# EAGLE design xerife (EAGLE 5.06)
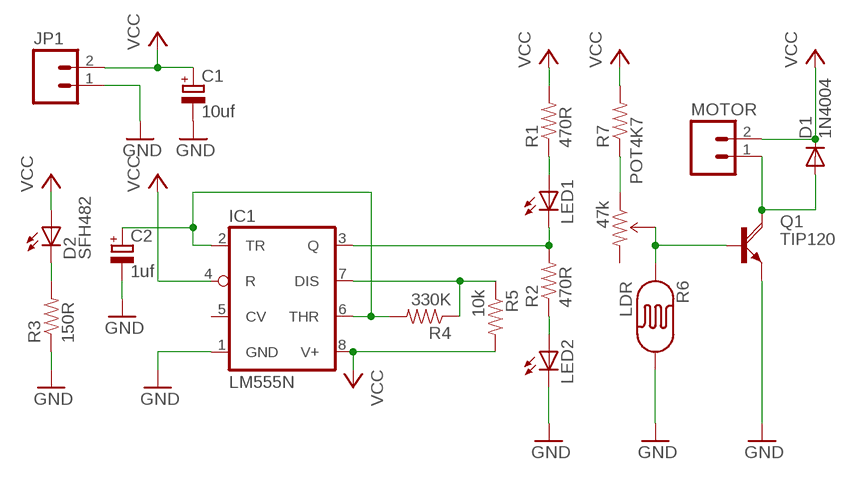
[diagram p0: schematic, sheet 1]

## Parts
C1  10uf  CPOL-EUE5-5  [E5-5]
C2  1uf  CPOL-EUE5-5  [E5-5]
D1  1N4004  [DO41-10]
D2  SFH482  [SFH482]
IC1  LM555N  [DIL08-ROUND]
JP1  M025MM  [SCREWTERMINAL-5MM-2]
LED1  LED5MM  [LED5MM]
LED2  LED5MM  [LED5MM]
MOTOR  M021X02_NO_SILK  [1X02_NO_SILK]
POT  47k  TRIMPOTPTH  [TRIM_POT_PTH]
Q1  TIP120  [TO220AH]
R1  470R  RESISTORPTH-1/4W  [AXIAL-0.4]
R2  470R  RESISTORPTH-1/4W  [AXIAL-0.4]
R3  150R  RESISTORPTH-1/4W  [AXIAL-0.4]
R4  330K  RESISTORPTH-1/4W  [AXIAL-0.4]
R5  10k  RESISTORPTH-1/4W  [AXIAL-0.4]
R6  LDR  PHOTOCELLPTH-KIT  [PHOTOCELL-KIT]
R7  4K7  RESISTORPTH-1/4W  [AXIAL-0.4]

## Nets
GND: C1.- C2.- IC1.1(GND) JP1.1 LED2.K(C) Q1.E R3.P$1 R6.2
N$1: LED1.A R1.P$1
N$2: IC1.3(Q) LED1.K(C) R2.P$2
N$3: LED2.A R2.P$1
N$4: C2.+ IC1.2(TR) IC1.6(THR) R4.P$2
N$5: IC1.7(DIS) R4.P$1 R5.P$1
N$6: D2.K(C) R3.P$2
N$7: D1.A MOTOR.1 Q1.C
N$8: POT.1(CCW) R7.P$1
N$9: POT.2(WIPER) Q1.B R6.1
VCC: C1.+ D1.C D2.A IC1.4(R) IC1.8(V+) JP1.2 MOTOR.2 R1.P$2 R5.P$2 R7.P$2
Unconnected: IC1.5(CV) POT.3(CW)

## Library data of the parts
C1 C2 = rcl:CPOL-EU: POLARIZED CAPACITOR, European symbol
D1 = adafruit:1N4004: DIODE General purpose 1N400x type rectifier (With bigger pads) http://www.ladyada.net/library/pcb/eaglelibrary.html
D2 = led:SFH482: IR LED infrared emitting diode, Infineon
IC1 = adafruit:*555: TIMER Changed DIP package to have round (not oval) pin pads http://www.ladyada.net/library/pcb/eaglelibrary.html
JP1 MOTOR = SparkFun:M02: Header 2 Standard 2-pin 0.1" header. Use with straight break away headers (SKU : PRT-00116), right angle break away headers (PRT-00553), swiss pins (PRT-00743), machine pins (PRT-00117), and female headers (PRT-00115). Molex polarized connector foot print use with SKU : PRT-08233 with associated crimp pins and housings.
LED1 LED2 = adafruit:LED: LED OSRAM: - CHIPLED LG R971, LG N971, LY N971, LG Q971, LY Q971, LO R971, LY R971 LH N974, LH R974 LS Q976, LO Q976, LY Q976 LO Q996 - Hyper CHIPLED LW Q18S LB Q993, LB Q99A, LB R99A - SideLED LS A670, LO A670, LY A670, LG A670, LP A670 LB A673, LV A673, LT A673, LW A673 LH A674 LY A675 LS A676, LA A676, LO A676, LY A676, LW A676 LS A679, LY A679, LG A679 - Hyper Micro SIDELED® LS Y876, LA Y876, LO Y876, LY Y876 LT Y87S - SmartLED LW L88C, LW L88S LB L89C, LB L89S, LG L890 LS L89K, LO L89K, LY L89K LS L896, LA L896, LO L896, LY L896 - TOPLED LS T670, LO T670, LY T670, LG T670, LP T670 LSG T670, LSP T670, LSY T670, LOP T670, LYG T670 LG T671, LOG T671, LSG T671 LB T673, LV T673, LT T673, LW T673 LH T674 LS T676, LA T676, LO T676, LY T676, LB T676, LH T676, LSB T676, LW T676 LB T67C, LV T67C, LT T67C, LS T67K, LO T67K, LY T67K, LW E67C LS E67B, LA E67B, LO E67B, LY E67B, LB E67C, LV E67C, LT E67C LW T67C LS T679, LY T679, LG T679 LS T770, LO T770, LY T770, LG T770, LP T770 LB T773, LV T773, LT T773, LW T773 LH T774 LS E675, LA E675, LY E675, LS T675 LS T776, LA T776, LO T776, LY T776, LB T776 LHGB T686 LT T68C, LB T68C - Hyper Mini TOPLED® LB M676 - Mini TOPLED Santana® LG M470 LS M47K, LO M47K, LY M47K Source: http://www.osram.convergy.de/
POT = SparkFun:TRIMPOT
Q1 = transistor-power:TIP120: NPN DARLINGTON TRANSISTOR
R1-R5 R7 = SparkFun:RESISTOR: Resistor Basic schematic elements and footprints for 0603, 1206, and PTH resistors.
R6 = SparkFun:PHOTOCELL: Photocell Also known as a CdS photoresistor. This is a low cost way to detect light levels. Resistance decreases with more incoming light. SparkFun SKU: SEN-09088

## Board
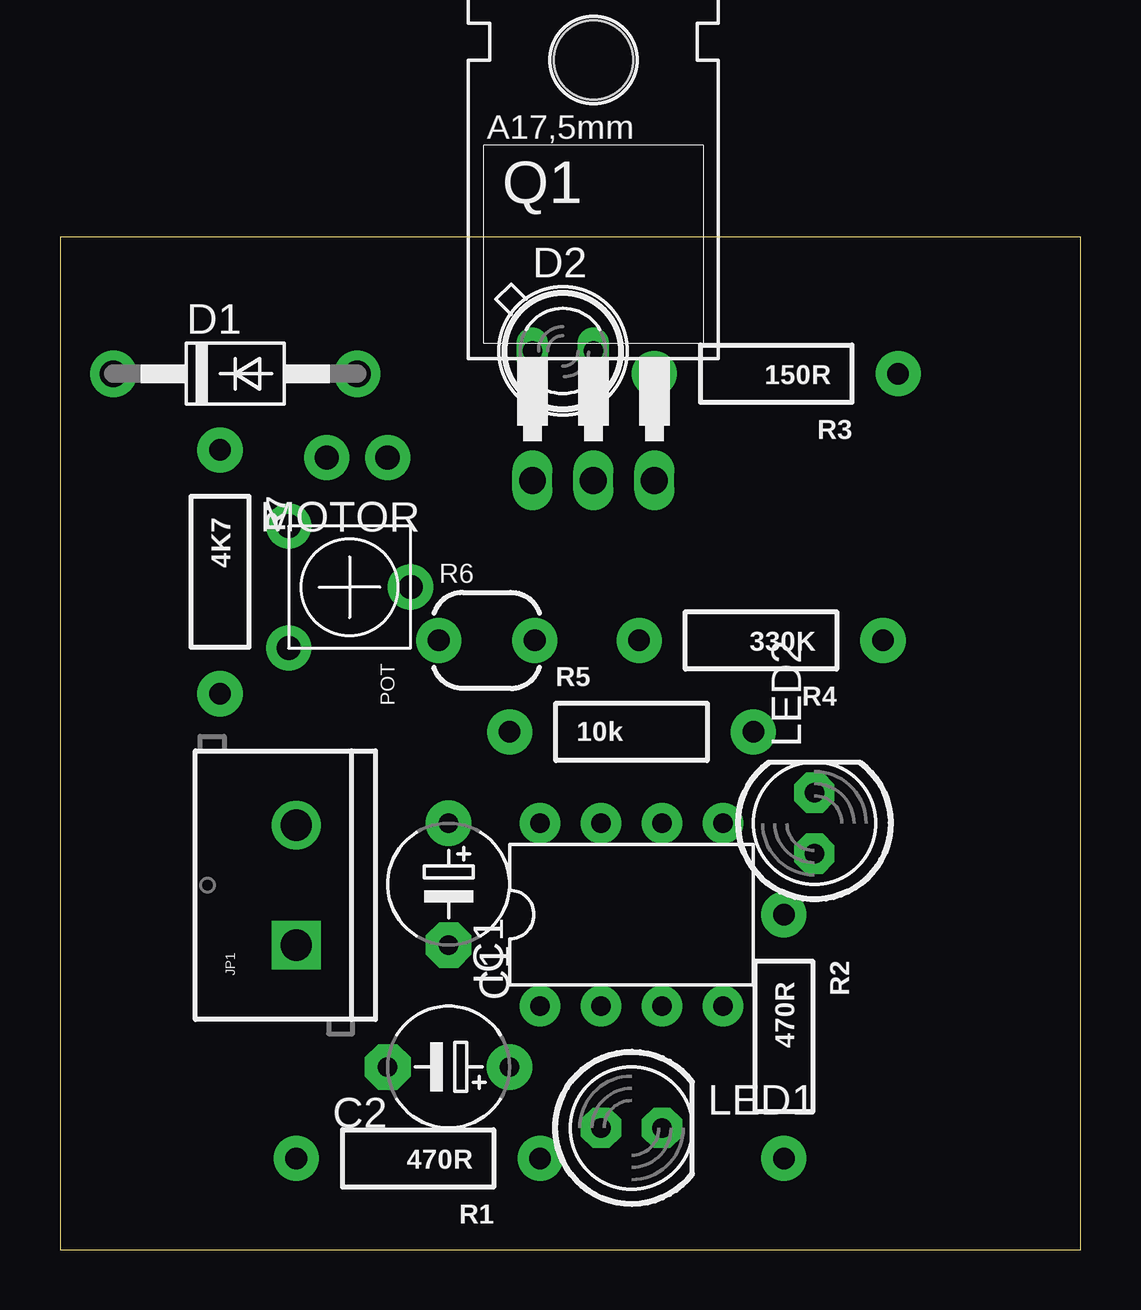
[diagram p1: board, top side]
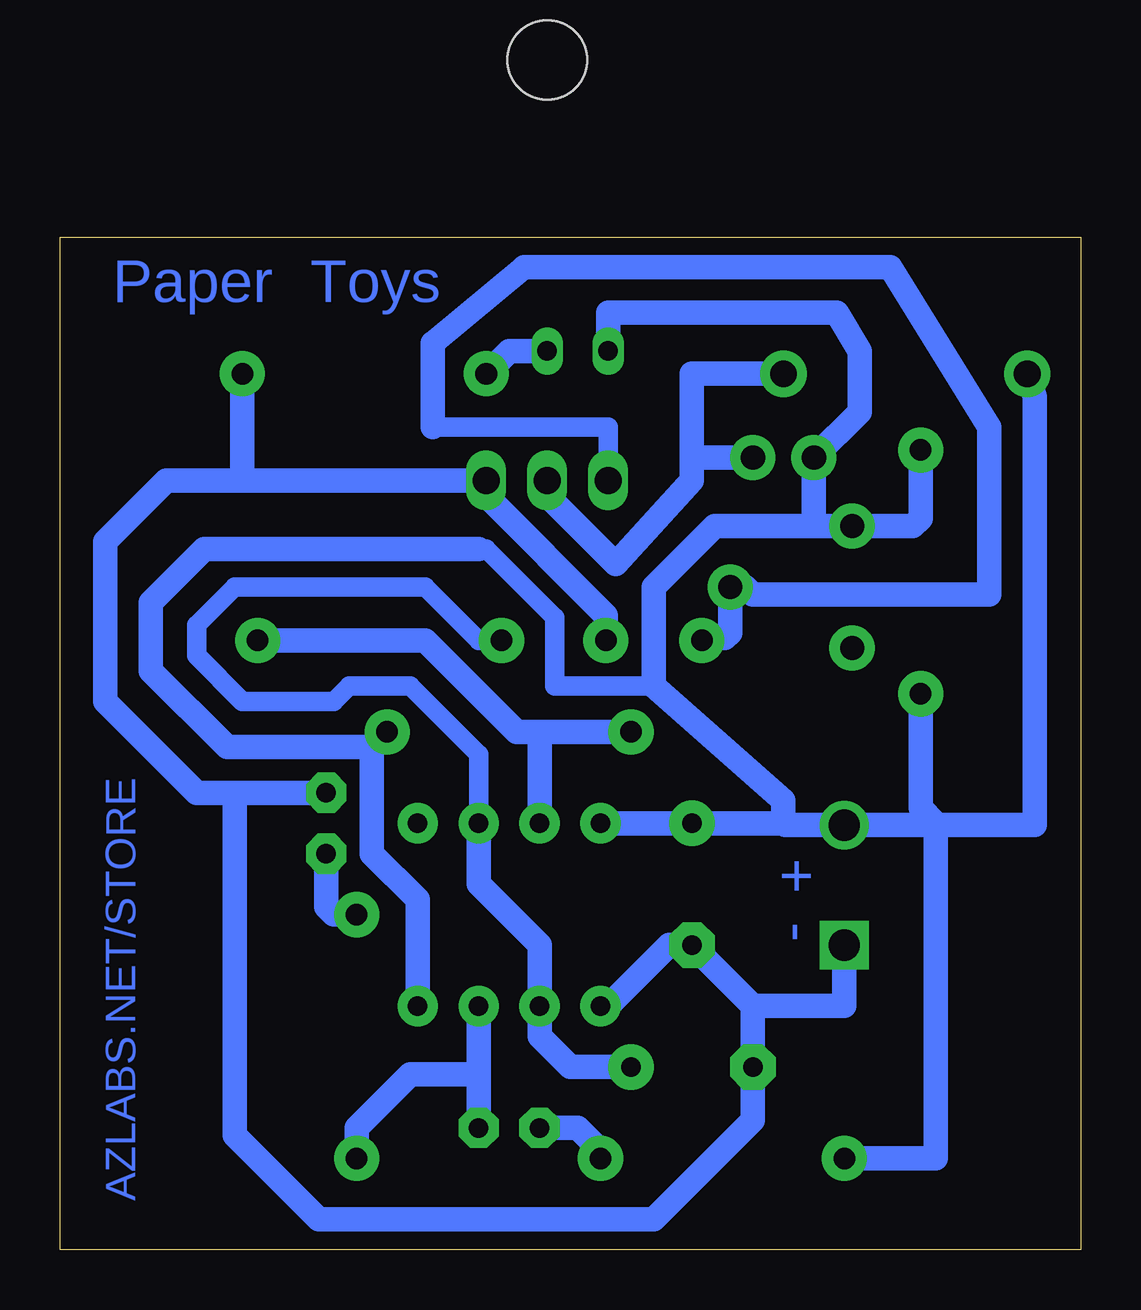
[diagram p2: board, bottom side, seen from below]

Size 42.52 x 42.22 mm. Coordinates in mm from the lower left corner, seen from the top.
Outline: 0,0 42.52,0 42.52,42.22 0,42.22 0,0
Copper layers (1*16): Top 0.035mm / dielectric 1.5mm / Bottom 0.035mm
Design rules "default *": minimum track width 32mil, minimum drill 24mil, track to track 8mil, track to pad 8mil, pad to pad 8mil, via to via 8mil, smd to smd 8mil, copper to edge 40mil, drill to drill 8mil, minimum pad ring 10mil, minimum via ring 8mil, stop-mask expansion 4mil, vias tented up to drill 0mil, thermal gap 10mil

### Footprints (pad centres in the part's own frame; a part is rotated, then mirrored left to right if it is on the bottom)
E5-5 = drill 0.813 pad 1.905 round: + -2.54,0 | drill 0.813 pad 1.905 octagon: - 2.54,0
DO41-10 = drill 1.118 pad 1.93 round: A 5.08,0; C -5.08,0
SFH482 = drill 0.813 long: A -1.27,0; K 1.27,0
DIL08-ROUND = drill 0.813 pad 1.676 round: 1 -3.81,-3.81; 2 -1.27,-3.81; 3 1.27,-3.81; 4 3.81,-3.81; 5 3.81,3.81; 6 1.27,3.81; 7 -1.27,3.81; 8 -3.81,3.81
SCREWTERMINAL-5MM-2 = drill 1.3 pad 2.032 square: 1 0,0 | drill 1.3 pad 2.032 round: 2 5,0
LED5MM = drill 0.813 pad 1.676 octagon: A -1.27,0; K 1.27,0
1X02_NO_SILK = drill 1.016 pad 1.88 round: 1 0,0; 2 2.54,0
TRIM_POT_PTH = drill 1 pad 1.88 round: 1 -2.54,-2.54; 2 0,2.54; 3 2.54,-2.54
TO220AH = drill 1.118 long: B -2.54,-6.35; C 0,-6.35; E 2.54,-6.35 | hole 3.302: 0,11.176
AXIAL-0.4 = drill 0.9 pad 1.88 round: P$1 -5.08,0; P$2 5.08,0
PHOTOCELL-KIT = drill 0.9 pad 1.88 round: 1 -2,0; 2 2,0

### Placement (x,y rotation side)
C1  16.19,15.24 270 top
C2  16.19,7.62 180 top
D1  7.3,36.51 0 top
D2  20.96,37.47 0 top
IC1  23.81,13.97 0 top
JP1  9.84,12.7 90 top
LED1  23.81,5.08 0 top
LED2  31.43,17.78 90 top
MOTOR  13.65,33.02 180 top
POT  12.07,27.62 270 top
Q1  22.23,38.42 0 top
R1  14.92,3.81 180 top
R2  30.16,8.89 270 top
R3  29.84,36.51 180 top
R4  29.21,25.4 180 top
R5  23.81,21.59 0 top
R6  17.78,25.4 0 top
R7  6.67,28.26 270 top

### Tracks (layer width: path | path; a pad name or v marks a point on that pad's centre or on a via)
GND
  Bottom 0.813: 28.13,1.27 28.15,1.25 28.16,1.27
  Bottom 1.016: 28.13,1.27 17.78,1.27 13.65,5.4 C2.- 13.65,10.16 | 28.16,1.27 31.75,1.27 35.24,4.76 35.24,19.05 | IC1.1 19.69,10.16 17.14,12.7 C1.- 13.65,10.16 | JP1.1 9.84,10.16 13.65,10.16 | 35.24,19.05 LED2.K | 35.24,19.05 36.83,19.05 40.64,22.86 40.64,29.53 38.1,32.07 34.92,32.07 | R6.2 19.78,26.45 24.77,31.43 Q1.E 34.92,32.07 | 34.92,32.07 R3.P$1
N$1
  Bottom 1.016: R1.P$1 20,4.13 20.96,5.08 LED1.A
N$2
  Bottom 1.016: LED1.K 25.08,7.3 | R2.P$2 30.16,5.08 27.94,7.3 25.08,7.3 | 25.08,7.3 IC1.3
N$3
  Bottom 1.016: R2.P$1 31.12,13.97 31.43,14.29 LED2.A
N$4
  Bottom 0.813: R4.P$2 25.08,25.4 27.3,27.62 35.24,27.62 36.83,26.04 36.83,24.77 34.92,22.86 31.12,22.86 30.48,23.49 27.94,23.49 25.08,20.64 IC1.6
  Bottom 1.016: C2.+ 21.27,7.62 22.54,8.89 IC1.2 22.54,12.7 25.08,15.24 IC1.6
N$5
  Bottom 1.016: R4.P$1 27.3,25.4 23.5,21.59 22.54,21.59 | 22.54,21.59 IC1.7 | R5.P$1 22.54,21.59
N$6
  Bottom 1.016: R3.P$2 23.81,37.47 D2.K
N$7
  Bottom 1.016: 16.19,33.02 16.19,32.07 19.37,28.58 22.23,31.43 Q1.C | 16.19,33.02 16.19,36.51 D1.A | MOTOR.1 16.19,33.02
N$8
  Bottom 1.016: POT.1 6.99,30.16 6.67,30.48 R7.P$1
N$9
  Bottom 0.813: Q1.B 19.69,34.29 26.99,34.29
  Bottom 1.016: R6.1 15.46,25.49 14.83,25.49 14.61,25.72 POT.2 13.97,27.62 13.65,27.31 3.81,27.31 3.81,34.29 7.94,40.96 23.18,40.96 26.99,37.78 26.99,34.29
VCC
  Bottom 0.813: 17.78,23.49 21.91,23.49 21.91,26.35 24.77,29.21 25.08,29.21
  Bottom 1.016: R1.P$2 6.03,3.81 6.03,17.78 | 6.35,17.7 6.11,17.7 6.03,17.78 | 6.35,17.7 JP1.2 12.3,17.7 12.38,17.78 | IC1.8 C1.+ 12.38,17.78 | 12.38,17.78 12.38,18.73 17.78,23.49 17.78,27.62 15.24,30.16 11.11,30.16 | IC1.4 27.62,14.6 29.53,16.51 29.53,20.95 | 29.53,20.95 R5.P$2 | 29.53,20.95 35.56,20.95 38.73,24.13 38.73,26.99 36.51,29.21 25.08,29.21 | 11.11,30.16 9.84,30.16 | 11.11,30.16 MOTOR.2 9.21,34.93 9.21,37.47 10.16,39.05 19.69,39.05 D2.A | 6.35,17.7 1.91,17.7 1.91,35.56 D1.C | R7.P$2 6.67,18.42 6.03,17.78

### Text on the board
Bottom: Toys | Paper | AZLABS.NET/STORE | + | -